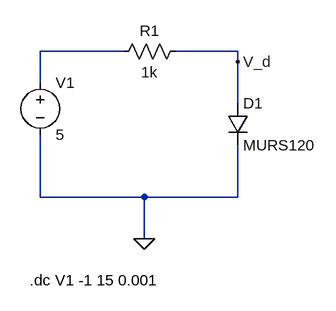
[diagram p0: schematic Lab_1_19201063_FahmidBinKibria.asc]
Lab_1_19201063_FahmidBinKibria.asc, the LTspice schematic file:
Version 4
SHEET 1 880 680
WIRE 224 48 96 48
WIRE 400 48 304 48
WIRE 400 64 400 48
WIRE 96 96 96 48
WIRE 400 128 400 64
WIRE 96 272 96 176
WIRE 256 272 96 272
WIRE 400 272 400 192
WIRE 400 272 256 272
WIRE 256 336 256 272
FLAG 256 336 0
FLAG 400 64 V_d
SYMBOL voltage 96 80 R0
WINDOW 123 0 0 Left 0
WINDOW 39 0 0 Left 0
SYMATTR InstName V1
SYMATTR Value 5
SYMBOL res 320 32 R90
WINDOW 0 0 56 VBottom 2
WINDOW 3 32 56 VTop 2
SYMATTR InstName R1
SYMATTR Value 1k
SYMBOL diode 384 128 R0
SYMATTR InstName D1
SYMATTR Value MURS120
TEXT 80 400 Left 2 !.dc V1 -1 15 0.001

The netlist it stands for:
* Lab_1_19201063_FahmidBinKibria.asc
V1 N001 0 5
R1 V_d N001 1k
D1 V_d 0 MURS120
.model D D
.lib standard.dio
.dc V1 -1 15 0.001
.backanno
.end